# EAGLE schematic timer (EAGLE 6.5.0)
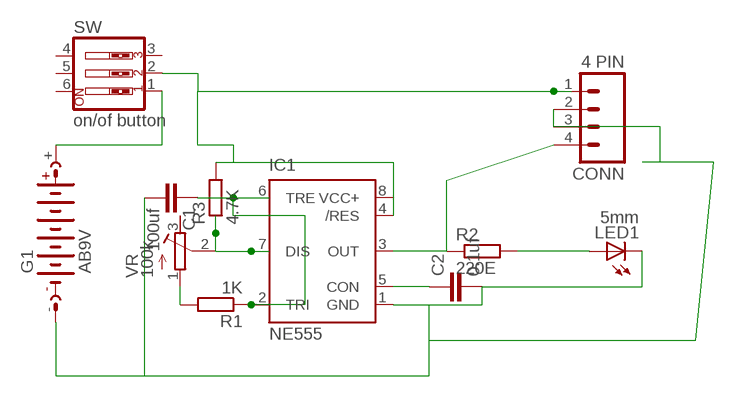
[diagram p0: schematic, sheet 1]

## Parts
C1  100uf  C-EU025-050X050  [C025-050X050]
C2  0.1uf  C-EU025-050X050  [C025-050X050]
CONN  4 PIN  M04  [04P]
G1  AB9V  [AB9V]
IC1  NE555  [DIL-08]
LED1  5mm  LED5MM  [LED5MM]
R1  1K  R-EU_0204/7  [0204/7]
R2  220E  R-EU_0204/7  [0204/7]
R3  4.7K  R-EU_0204/7  [0204/7]
SW  on/of button  SW_DIP-3  [EDG-03]
VR  100k  R-TRIMM64P  [RTRIM64P]

## Nets
N$1: C1.1 IC1.2(TRI) IC1.6(TRE) R1.1
N$2: C2.1 IC1.5(CON)
N$3: IC1.7(DIS) R3.1 VR.2(S)
N$4: CONN.4 IC1.3(OUT) R2.1
N$5: LED1.A R2.2
N$6: G1.+ SW.1
N$7: R1.2 VR.1(E)
N$9: C1.2 C2.2 CONN.2 CONN.3 G1.- IC1.1(GND) LED1.K(C)
N$11: CONN.1 IC1.4(/RES) IC1.8(VCC+) R3.2 SW.2
Unconnected: SW.3 SW.4 SW.5 SW.6 VR.3(A)

## Library data of the parts
C1 C2 = rcl:C-EU: CAPACITOR, European symbol
CONN = con-amp-quick:M04: AMP QUICK CONNECTOR; OC_FARNELL: unknown; OC_NEWARK: unknown
G1 = battery:AB9V: 9-V BATTERY CLIP
IC1 = st-microelectronics:NE555: General purpose bipolar Timer; MF: Arrow Electronics; MPN: NE555N; OC_FARNELL: 1467742; OC_NEWARK: 89K1486
LED1 = led:LED: LED OSRAM: - CHIPLED LG R971, LG N971, LY N971, LG Q971, LY Q971, LO R971, LY R971 LH N974, LH R974 LS Q976, LO Q976, LY Q976 LO Q996 - Hyper CHIPLED LW Q18S LB Q993, LB Q99A, LB R99A - SideLED LS A670, LO A670, LY A670, LG A670, LP A670 LB A673, LV A673, LT A673, LW A673 LH A674 LY A675 LS A676, LA A676, LO A676, LY A676, LW A676 LS A679, LY A679, LG A679 - Hyper Micro SIDELED® LS Y876, LA Y876, LO Y876, LY Y876 LT Y87S - SmartLED LW L88C, LW L88S LB L89C, LB L89S, LG L890 LS L89K, LO L89K, LY L89K LS L896, LA L896, LO L896, LY L896 - TOPLED LS T670, LO T670, LY T670, LG T670, LP T670 LSG T670, LSP T670, LSY T670, LOP T670, LYG T670 LG T671, LOG T671, LSG T671 LB T673, LV T673, LT T673, LW T673 LH T674 LS T676, LA T676, LO T676, LY T676, LB T676, LH T676, LSB T676, LW T676 LB T67C, LV T67C, LT T67C, LS T67K, LO T67K, LY T67K, LW E67C LS E67B, LA E67B, LO E67B, LY E67B, LB E67C, LV E67C, LT E67C LW T67C LS T679, LY T679, LG T679 LS T770, LO T770, LY T770, LG T770, LP T770 LB T773, LV T773, LT T773, LW T773 LH T774 LS E675, LA E675, LY E675, LS T675 LS T776, LA T776, LO T776, LY T776, LB T776 LHGB T686 LT T68C, LB T68C - Hyper Mini TOPLED® LB M676 - Mini TOPLED Santana® LG M470 LS M47K, LO M47K, LY M47K Source: http://www.osram.convergy.de LUXEON: - LUMILED® LXK2-PW12-R00, LXK2-PW12-S00, LXK2-PW14-U00, LXK2-PW14-V00 LXK2-PM12-R00, LXK2-PM12-S00, LXK2-PM14-U00 LXK2-PE12-Q00, LXK2-PE12-R00, LXK2-PE12-S00, LXK2-PE14-T00, LXK2-PE14-U00 LXK2-PB12-K00, LXK2-PB12-L00, LXK2-PB12-M00, LXK2-PB14-N00, LXK2-PB14-P00, LXK2-PB14-Q00 LXK2-PR12-L00, LXK2-PR12-M00, LXK2-PR14-Q00, LXK2-PR14-R00 LXK2-PD12-Q00, LXK2-PD12-R00, LXK2-PD12-S00 LXK2-PH12-R00, LXK2-PH12-S00 LXK2-PL12-P00, LXK2-PL12-Q00, LXK2-PL12-R00 Source: www.luxeon.com KINGBRIGHT: KA-3528ASYC Source: www.kingbright.com
R1-R3 = rcl:R-EU_: RESISTOR, European symbol
SW = special:SW_DIP-3: DIP SWITCH
VR = resistor:R-TRIMM: Trimm resistor